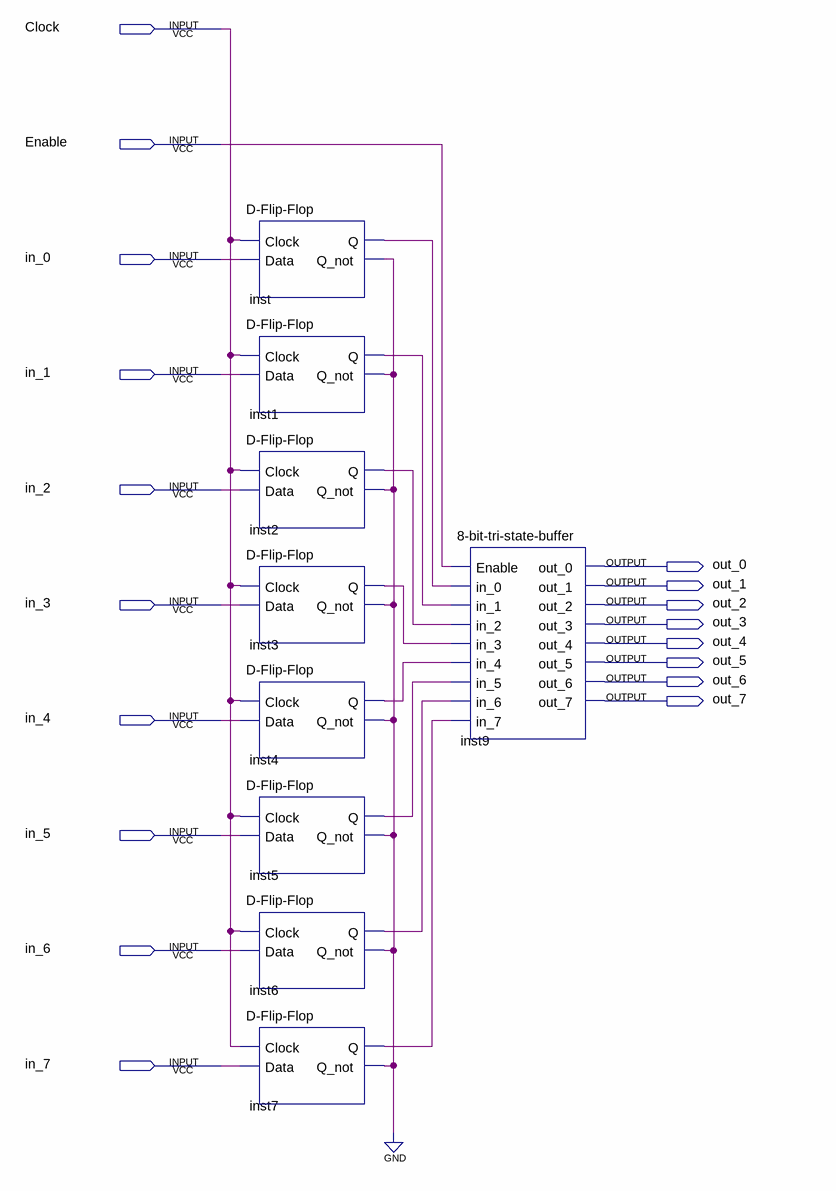
[diagram p0: schematic sheet]
// Quartus schematic 8-bit-register.bdf as structural Verilog: 9 symbols, 18 pins
module \8-bit-register  (
  input  Clock,
  input  Enable,
  input  in_0,
  input  in_1,
  input  in_2,
  input  in_3,
  input  in_4,
  input  in_5,
  input  in_6,
  input  in_7,
  output out_0,
  output out_1,
  output out_2,
  output out_3,
  output out_4,
  output out_5,
  output out_6,
  output out_7
);

  wire inst1_q, inst2_q, inst3_q, inst4_q, inst5_q, inst6_q, inst7_q, inst_q, inst_q_not;

  \D-Flip-Flop  inst (.Clock(Clock), .Data(in_0), .Q(inst_q), .Q_not(inst_q_not));
  \D-Flip-Flop  inst1 (.Clock(Clock), .Data(in_1), .Q(inst1_q), .Q_not(inst_q_not));
  \D-Flip-Flop  inst2 (.Clock(Clock), .Data(in_2), .Q(inst2_q), .Q_not(inst_q_not));
  \D-Flip-Flop  inst3 (.Clock(Clock), .Data(in_3), .Q(inst3_q), .Q_not(inst_q_not));
  \D-Flip-Flop  inst4 (.Clock(Clock), .Data(in_4), .Q(inst4_q), .Q_not(inst_q_not));
  \D-Flip-Flop  inst5 (.Clock(Clock), .Data(in_5), .Q(inst5_q), .Q_not(inst_q_not));
  \D-Flip-Flop  inst6 (.Clock(Clock), .Data(in_6), .Q(inst6_q), .Q_not(inst_q_not));
  \D-Flip-Flop  inst7 (.Clock(Clock), .Data(in_7), .Q(inst7_q), .Q_not(inst_q_not));
  \8-bit-tri-state-buffer  inst9 (
    .Enable(Enable), .in_0(inst_q), .in_1(inst1_q), .in_2(inst2_q), .in_3(inst3_q), .in_4(inst4_q),
    .in_5(inst5_q), .in_6(inst6_q), .in_7(inst7_q), .out_0(out_0), .out_1(out_1), .out_2(out_2),
    .out_3(out_3), .out_4(out_4), .out_5(out_5), .out_6(out_6), .out_7(out_7));
  // also tied to GND on the sheet: inst_q_not
endmodule
